# EAGLE design esp_board (EAGLE 7.7.0)
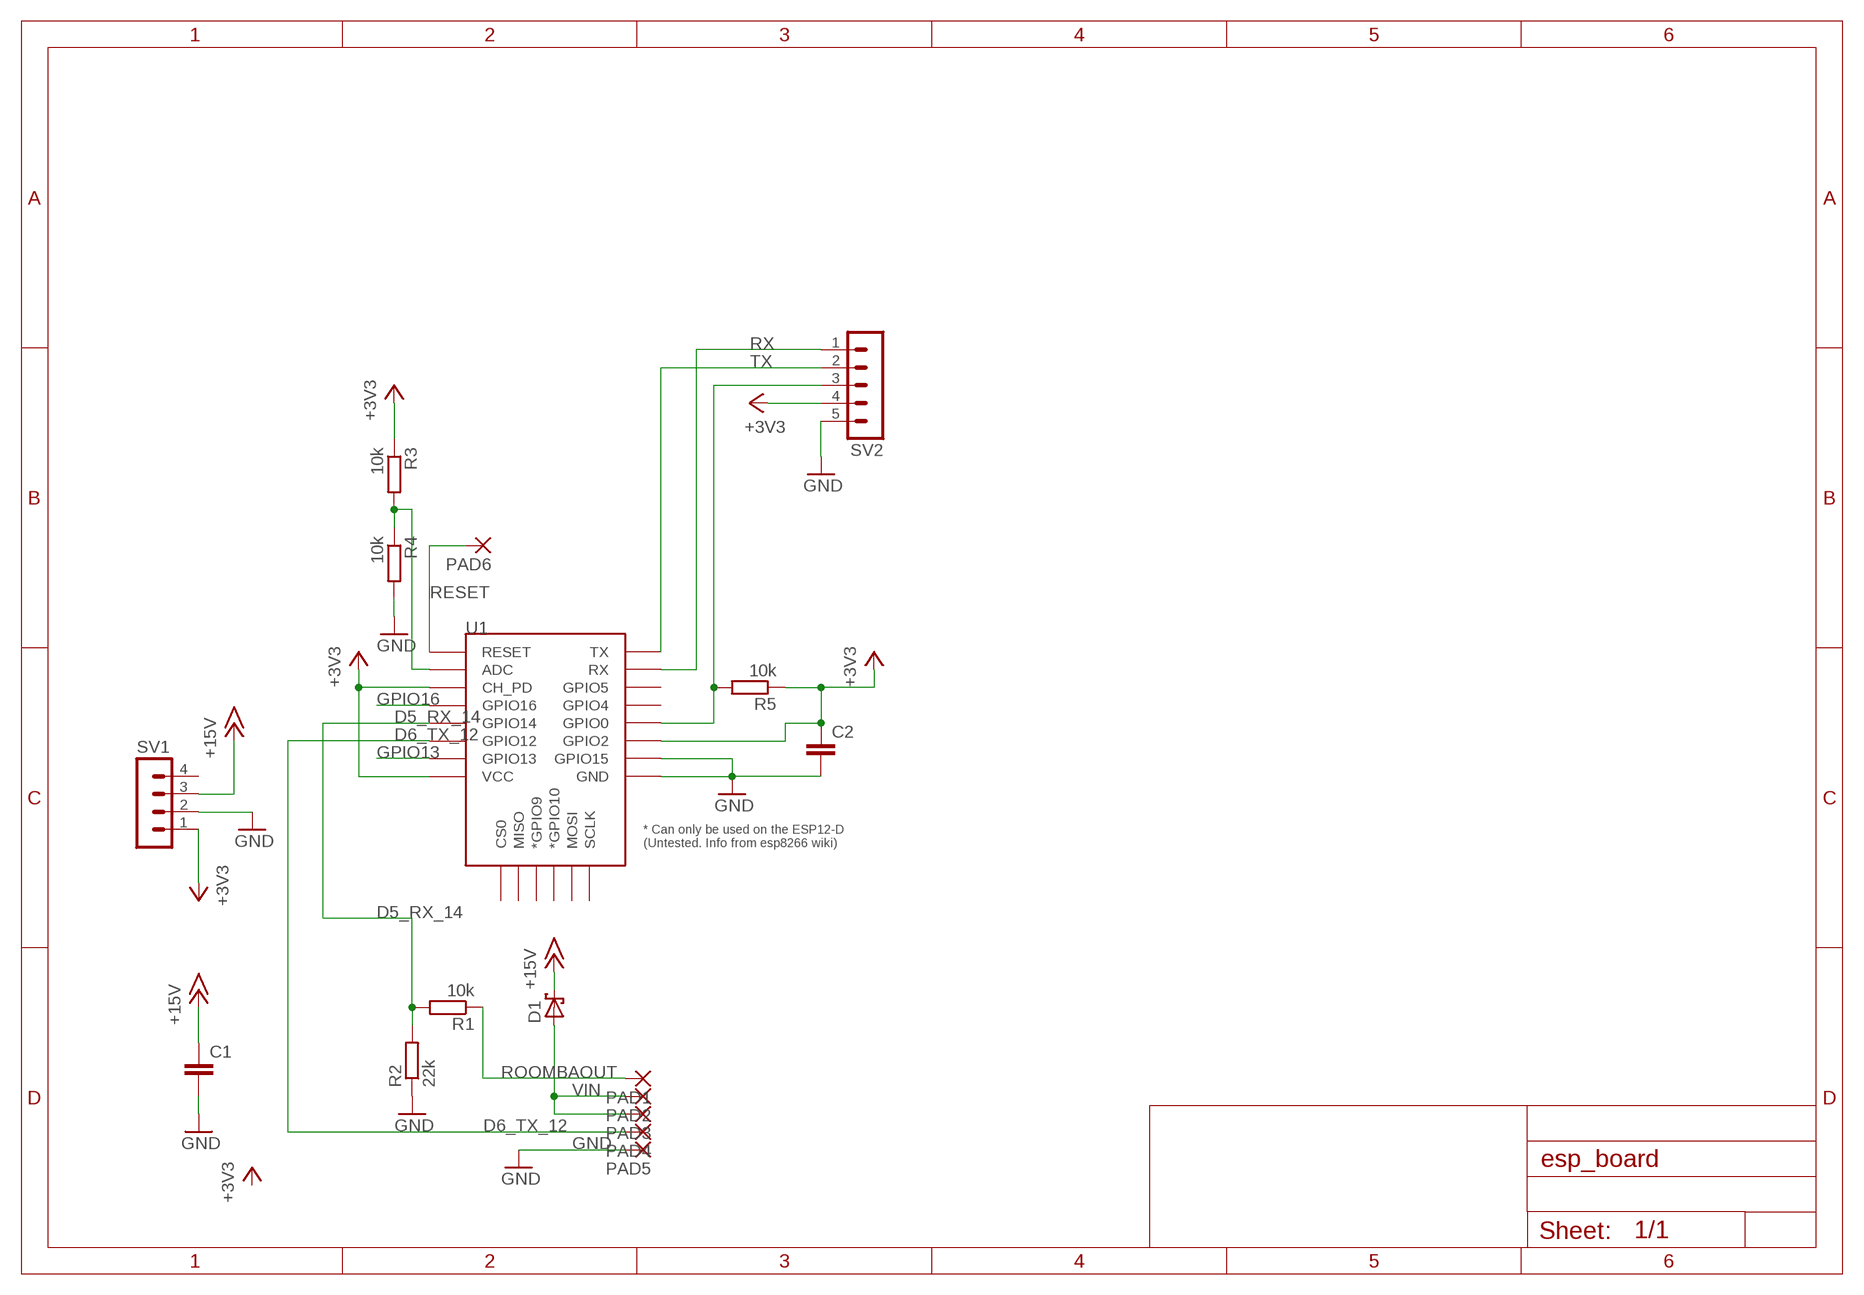
[diagram p0: schematic, sheet 1]

## Parts
C1  C-EUC3225  [C3225]
C2  C-EUC3225  [C3225]
D1  SCHOTTKY-DIODESMC  [SMC]
PAD1  1,6/0,8  [1,6/0,8]
PAD2  1,6/0,8  [1,6/0,8]
PAD3  1,6/0,8  [1,6/0,8]
PAD4  1,6/0,8  [1,6/0,8]
PAD5  1,6/0,8  [1,6/0,8]
PAD6  SMD2  [SMD1,27-2,54]
R1  10k  R-EU_R0805  [R0805]
R2  22k  R-EU_R0805  [R0805]
R3  10k  R-EU_R0805  [R0805]
R4  10k  R-EU_R0805  [R0805]
R5  10k  R-EU_R0805  [R0805]
SV1  MA04-1  [MA04-1]
SV2  MA05-1  [MA05-1]
U1  ESP12ESMD  [ESP12E-SMD]

## Nets
+3V3: C2.1 R3.1 R5.1 SV1.1 SV2.4 U1.CH_PD U1.GPIO2 U1.VCC
+15V: C1.1 D1.C SV1.3
ADC: R3.2 R4.1 U1.ADC
D5_RX_14: R1.2 R2.2 U1.GPIO14
D6_TX_12: PAD4.1(P) U1.GPIO12
GND: C1.2 C2.2 PAD5.1(P) R2.1 R4.2 SV1.2 SV2.5 U1.GND U1.GPIO15
GPIO0: R5.2 SV2.3 U1.GPIO0
GPIO13: U1.GPIO13
GPIO16: U1.GPIO16
RESET: PAD6.1(P) U1.RESET
ROOMBAOUT: PAD1.1(P) R1.1
RX: SV2.1 U1.RXD0(RX)
TX: SV2.2 U1.TXD0(TX)
VIN: D1.A PAD2.1(P) PAD3.1(P)
Unconnected: SV1.4 U1.CS0 U1.GPIO4 U1.GPIO5 U1.GPIO9(*GPIO9) U1.GPIO10(*GPIO10) U1.MISO U1.MOSI U1.SCLK

## Library data of the parts
C1 C2 = rcl:C-EU: CAPACITOR, European symbol
D1 = diode:SCHOTTKY-DIODE: Schottky Diode
PAD1-PAD5 = wirepad:1,6/0,8: THROUGH-HOLE PAD
PAD6 = wirepad:SMD2: SMD PAD
R1-R5 = rcl:R-EU_: RESISTOR, European symbol
SV1 = con-lstb:MA04-1: PIN HEADER; OC_FARNELL: unknown; OC_NEWARK: unknown
SV2 = con-lstb:MA05-1: PIN HEADER; OC_FARNELL: unknown; OC_NEWARK: unknown
U1 = esp8266modules:ESP12E: ESP12E Module

## Board
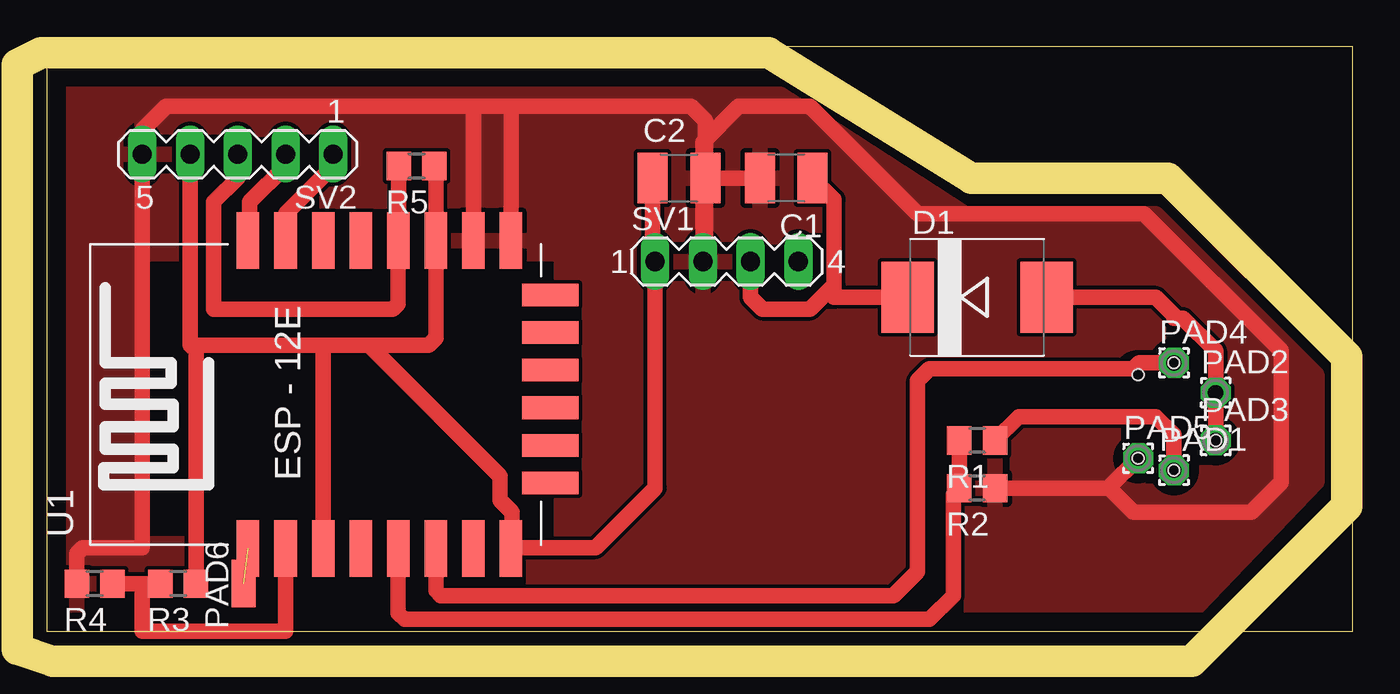
[diagram p1: board, top side]

Size 69.52 x 31.11 mm. Coordinates in mm from the lower left corner, seen from the top.
Outline: 0,0 69.52,0 69.52,31.11 0,31.11 0,0
Copper layers (1*16): Top 0.035mm / dielectric 1.5mm / Bottom 0.035mm
Design rules "default": minimum track width 10mil, minimum drill 24mil, track to track 8mil, track to pad 8mil, pad to pad 8mil, via to via 8mil, smd to smd 8mil, copper to edge 40mil, drill to drill 8mil, minimum pad ring 10mil, minimum via ring 8mil, stop-mask expansion 4mil, vias tented up to drill 0mil, thermal gap 10mil
Holes 0.6 mm at 60.01,14.29 58.1,13.65 58.1,9.21 60.01,8.57 62.23,10.16
tRestrict: area 5.4,5.1 to 27,19.7
Milling: 10 lines

### Footprints (pad centres in the part's own frame; a part is rotated, then mirrored left to right if it is on the bottom)
C3225 = smd 1.6 x 2.7: 1 -1.4,0; 2 1.4,0
SMC = smd 2.8 x 3.8: A 3.7,0; C -3.7,0
1,6/0,8 = drill 0.813 pad 1.6 octagon: 1 0,0
SMD1,27-2,54 = smd 1.27 x 2.54: 1 0,0
R0805 = smd 1.3 x 1.5: 1 -0.95,0; 2 0.95,0
MA04-1 = drill 1.016 long: 1 -3.81,0; 2 -1.27,0; 3 1.27,0; 4 3.81,0
MA05-1 = drill 1.016 long: 1 -5.08,0; 2 -2.54,0; 3 0,0; 4 2.54,0; 5 5.08,0
ESP12E-SMD = smd 3 x 1.2: ADC -8.3,3.8; CH_PD -8.3,1.8; GND 8.1,-8.2; GPIO0 8.1,-2.2; GPIO2 8.1,-4.2; GPIO4 8.1,-0.2; GPIO5 8.1,1.8; GPIO12 -8.3,-4.2; GPIO13 -8.3,-6.2; GPIO14 -8.3,-2.2; GPIO15 8.1,-6.2; GPIO16 -8.3,-0.2; RESET -8.3,5.8; RXD0 8.1,3.8; TXD0 8.1,5.8; VCC -8.3,-8.2 | smd 1.2 x 3: CS0 -4.8,-10.3; GPIO9 -0.8,-10.3; GPIO10 1.2,-10.3; MISO -2.8,-10.3; MOSI 3.2,-10.3; SCLK 5.2,-10.3

### Placement (x,y rotation side)
C1  39.37,24.13 180 top
C2  33.66,24.13 0 top
D1  49.53,17.78 0 top
PAD1  60.01,8.57 0 top
PAD2  62.23,12.7 0 top
PAD3  62.23,10.16 0 top
PAD4  60.01,14.29 0 top
PAD5  58.1,9.21 0 top
PAD6  10.48,2.54 0 top
R1  49.53,10.16 180 top
R2  49.53,7.62 180 top
R3  6.99,2.54 180 top
R4  2.54,2.54 180 top
R5  19.68,24.77 180 top
SV1  36.2,19.68 0 top
SV2  10.16,25.4 180 top
U1  16.51,12.7 90 top

### Tracks (layer width: path | path; a pad name or v marks a point on that pad's centre or on a via)
+3V3
  Top 0.813: SV2.4 7.62,15.24 | 7.62,15.24 14.61,15.24 | 14.61,15.24 17.14,15.24 | 17.14,15.24 24.13,8.26 24.13,6.99 24.77,6.35 24.77,4.46 | 24.77,4.46 U1.VCC | 24.77,4.46 29.22,4.46 32.38,7.62 SV1.1 32.26,19.82 C2.1 | U1.CH_PD 14.71,15.13 14.61,15.24 | 17.14,15.24 20.32,15.24 20.71,15.63 U1.GPIO2 20.71,24.69 R5.1 | R3.1 7.93,14.93 7.62,15.24
+15V
  Top 0.813: SV1.3 37.47,17.78 38.1,17.14 40.64,17.14 41.91,18.41 | 41.91,18.41 41.91,17.78 D1.C | 41.91,18.41 41.91,22.99 C1.1
ADC
  Top 0.813: R4.1 5.08,2.54 | 5.08,2.54 R3.2 | U1.ADC 12.71,0.01 12.06,0 5.08,0 5.08,2.54
D5_RX_14
  Top 0.813: U1.GPIO14 18.71,0.97 19.05,0.64 46.99,0.64 48.26,1.91 48.26,7.3 R2.2 R1.2
D6_TX_12
  Top 0.813: U1.GPIO12 20.71,2.15 20.95,1.91 45.09,1.91 46.35,3.17 46.35,13.34 46.99,13.97 57.85,13.97 58.17,14.29 PAD4.1
GND
  Top 0.813: 24.77,27.94 34.29,27.94 35.05,27.18 C2.2 | 24.77,27.94 22.86,27.94 | 22.86,27.94 6.35,27.94 5.08,26.67 SV2.5 5.08,4.45 1.91,4.45 1.59,4.13 R4.2 | C2.2 35.05,19.82 SV1.2 34.92,26.04 36.83,27.94 40.64,27.94 46.35,22.23 58.42,22.23 65.72,14.92 65.72,7.94 64.14,6.35 57.85,6.35 56.58,7.62 | C2.2 C1.2 | R2.1 56.58,7.62 | U1.GPIO15 22.71,27.79 22.86,27.94 | U1.GND 24.71,27.89 24.77,27.94 | 56.58,7.62 56.58,7.68 PAD5.1
  pour Top: 0,28.57 39.05,28.57 48.9,22.23 59.05,22.23 67.63,13.65 67.63,7.94 60.64,0.64 0,-0.32
GPIO0
  Top 0.813: R5.2 18.73,20.82 U1.GPIO0 18.71,17.44 18.41,17.14 8.89,17.14 8.89,22.86 10.16,24.13 SV2.3
RESET  (1 unrouted)
ROOMBAOUT
  Top 0.813: R1.1 51.75,11.43 59.05,11.43 60.01,10.48 PAD1.1
RX
  Top 0.813: U1.RXD0 12.71,22.23 15.24,24.77 SV2.1
TX
  Top 0.813: U1.TXD0 10.79,20.8 10.79,22.86 12.7,24.77 SV2.2
VIN
  Top 0.813: D1.A 59.05,17.78 60.09,16.75 60.01,16.66 60.49,16.66 62.23,14.92 PAD2.1 PAD3.1